# Altium project Solar_Plant_Project.PrjPcb
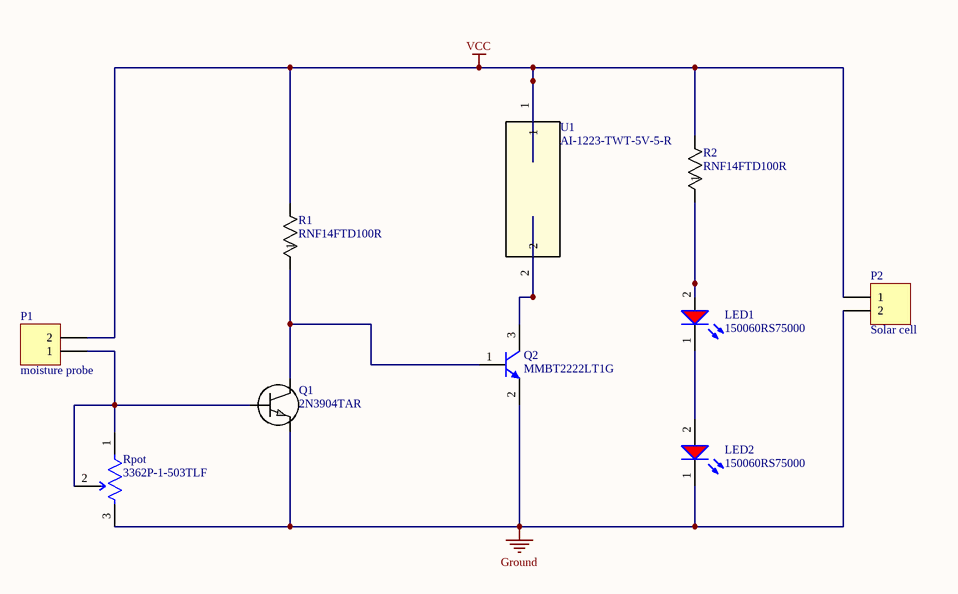
[diagram p0: Sheet1.SchDoc]
1 sheet, 10 parts. Net scope: global (net labels, ports and power ports of the same name join across sheets).
Board file: Solar_plant.PcbDoc

## Sheet Sheet1.SchDoc
size A; SheetNumber: 1; SheetTotal: 1

### Parts
LED1  150060RS75000  [WL-SMCW_0603_150060xx75000]
LED2  150060RS75000  [WL-SMCW_0603_150060xx75000]
P1  moisture probe  [HDR1X2]
P2  Solar cell  [HDR1X2]
Q1  2N3904TAR  [TO-92-3_135AR_ONS]
Q2  MMBT2222LT1G  [ONSC-SOT-23-3-318-08_V]
R1  RNF14FTD100R  [STA_RNF14_STP]
R2  RNF14FTD100R  [STA_RNF14_STP]
Rpot  3362P-1-503TLF  [FP-3362P-1-503TLF-MFG]
U1  AI-1223-TWT-5V-5-R  [AI-1223-TWT-5V-5-R_PUI]

### Nets
Ground: LED2.1(K) P2.2 Q1.1(E) Q2.2(E) Rpot.3(CW)
VCC: P1.2 P2.1 R1.2 R2.2 U1.1
NetLED1_1: LED1.1(K) LED2.2(A)
NetLED1_2: LED1.2(A) R2.1
NetP1_1: P1.1 Q1.2(B) Rpot.1(CCW) Rpot.2(WIPER)
NetQ1_3: Q1.3(C) Q2.1(B) R1.1
NetQ2_3: Q2.3(C) U1.2

### Library data of the parts
LED1 LED2 = CMP-1426-00001-3: NexarPartId: 29717776; Color: Red; Power Dissipation: 72mW; Max Reverse Voltage (DC): 5V; Peak Wavelength: 630nm; Viewing Angle: 140°; Forward Voltage: 2V; Luminous Intensity: 250mcd; Forward Current: 100mA; Dominant Wavelength: 625nm; Lens Style: Clear, Rectangular; Max Junction Temperature (Tj): 95°C; Test Current: 20mA; Mount: Surface Mount; Packaging: Tape and Reel; Case Code (Metric): 1608; Max Operating Temperature: 85°C; Case Code (Imperial): 0603; REACH SVHC: Unknown; Width: 800µm; Length: 1.6mm; Reverse Voltage: 5V; Height: 700µm; Case/Package: 0603; RoHS: Compliant; Wavelength: 625nm; Min Operating Temperature: -40°C
P1 P2 = Header 2: Header, 2-Pin; LatestRevisionDate: 17-Jul-2002; LatestRevisionNote: Re-released for DXP Platform.; Publisher: Altium Limited
Q1 = 2N3904TAR: No Description Available; Mfr_Name: onsemi; Type: DEV; Copyright: Copyright (C) 2024 Ultra Librarian. All rights reserved.; Manufacturer_Part_Number: 2N3904TAR; RefDes: RefDes
Q2 = CMP-0722-00001-2: General Purpose Transistor, NPN Silicon, 3-Pin SOT-23, Pb-Free, Tape and Reel; Manufacturer: On Semiconductor; IC Continuous (A): 0.6; fT Min (MHz): 250; DatasheetVersion: Rev. 10; ComponentLink3Description: Package Specification; PackageVersion: Rev. AP, 11/2009; ComponentLink3URL: http://www.onsemi.cn/pub_link/Collateral/318-08.PDF; ComponentLink1URL: http://www.onsemi.com/; ComponentLink2URL: http://www.onsemi.cn/pub_link/Collateral/MMBT2222LT1-D.PDF; ComponentLink2Description: Datasheet; RoHS: TRUE; Mounting Technology: Surface Mount; PartNumber: MMBT2222LT1G; ComponentLink1Description: Manufacturer URL; PackageDescription: 3-Pin Small Outline Transistor, Body 2.92 x 1.3 mm, Pitch 0.95 mm; Packing: Tape and Reel; Polarity: NPN; PackageReference: SOT-23-3-318-08
R1 R2 = RNF14FTD100R: No Description Available; Mfr_Name: Stackpole International; Copyright: Copyright (C) 2024 Ultra Librarian. All rights reserved.; Manufacturer_Part_Number: RNF14FTD100R; RefDes: RefDes; Type: DEV
Rpot = CMP-07234-000028-1: TRIMMER 50K OHM 0.5W PC PIN TOP; Temperature Coefficient: 100ppm/°C; Voltage Rating (DC): 300V; Resistance: 50kR; Power Rating: 500mW; Tolerance: 10%; Number of Turns: 1; Series: Trimpot® 3362 - Sealed; Military Standard: Not; Termination: Pin; Technology: CERMET; Depth: 7.04mm; RoHS Compliant: Yes; Max Operating Temperature: 125°C; Lead Free: Lead Free; Max Power Dissipation: 500mW; REACH SVHC: No SVHC; Min Operating Temperature: -55°C; Resistor Type: Cermet; Height: 0.185inch; Width: 4.7mm; Mount: Through Hole; Weight: 0.02oz; Length: 6.6mm; Resistance Tolerance: 10%; Package Quantity: 50; Radiation Hardening: No; Packaging: Rail/Tube
U1 = AI-1223-TWT-5V-5-R: No Description Available; Mfr_Name: PUI Audio; Copyright: Copyright (C) 2024 Ultra Librarian. All rights reserved.; Manufacturer_Part_Number: AI-1223-TWT-5V-5-R; RefDes: RefDes; Type: DEV